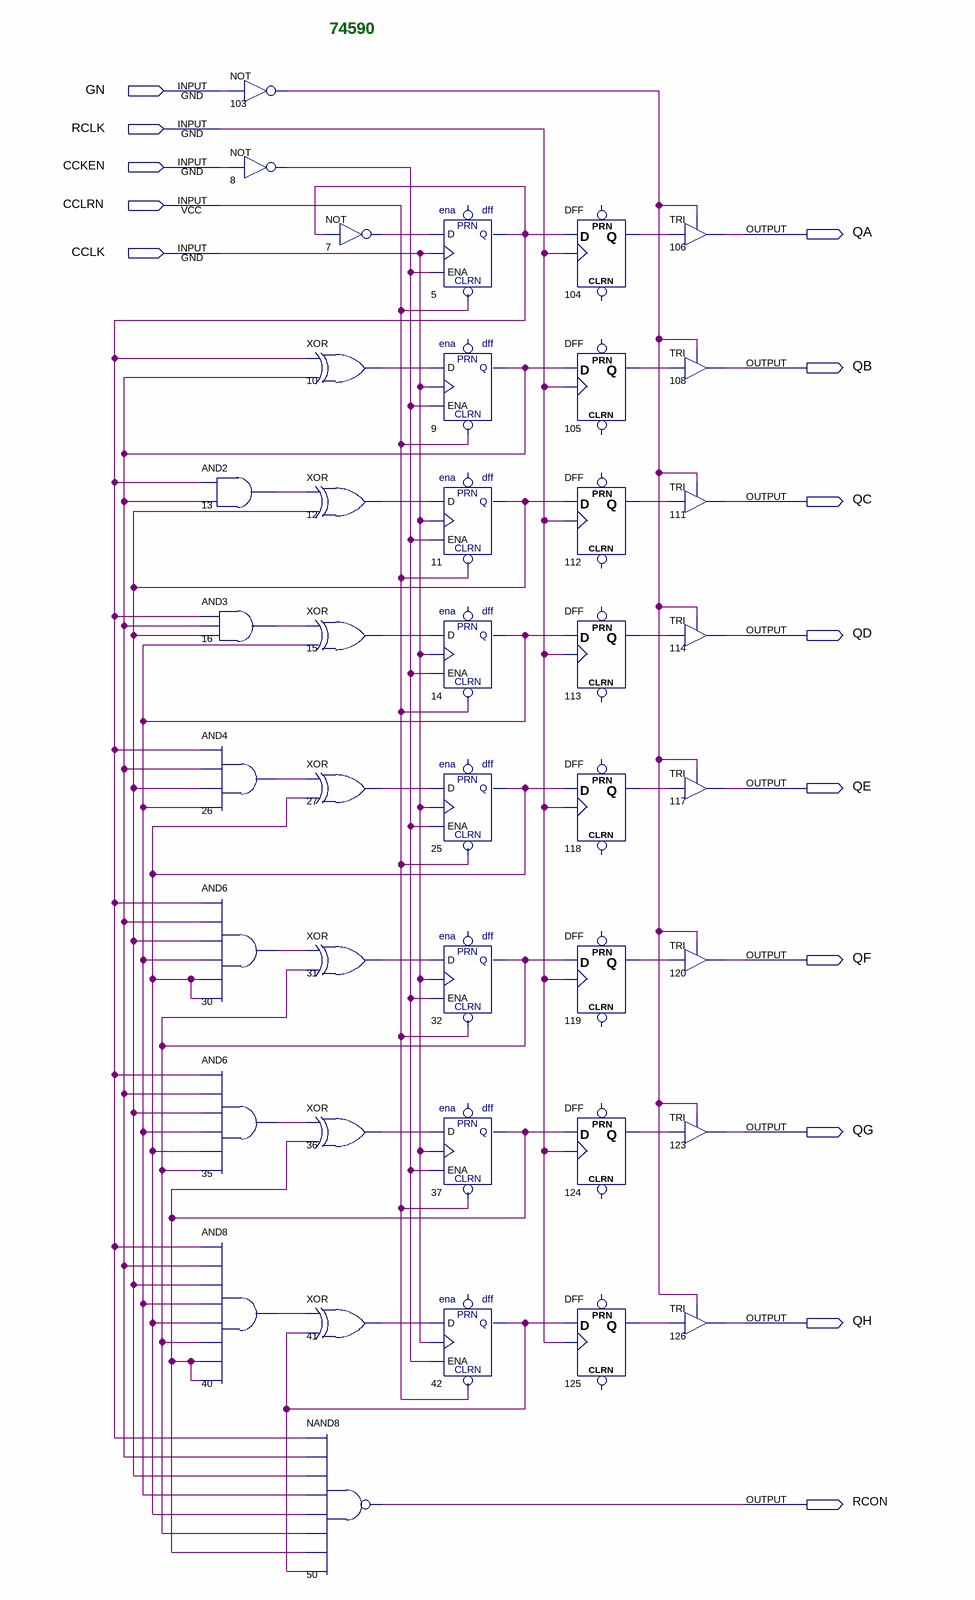
[diagram p0: schematic sheet]
// Quartus schematic 74590.bdf as structural Verilog: 41 symbols, 14 pins
module \74590  (
  input  GN,
  input  RCLK,
  input  CCKEN,
  input  CCLRN,
  input  CCLK,
  output QA,
  output QB,
  output QC,
  output QD,
  output QE,
  output QF,
  output QG,
  output QH,
  output RCON
);

  wire n5_q, n7_out, n8_out, n9_q, n10_out, n11_q, n12_out, n13_out, n14_q, n15_out, n16_out, n25_q, n26_out,
       n27_out, n30_out, n31_out, n32_q, n35_out, n36_out, n37_q, n40_out, n41_out, n42_q, n103_out, n104_q,
       n105_q, n112_q, n113_q, n118_q, n119_q, n124_q, n125_q;

  not u_103 (n103_out, GN);
  not u_8 (n8_out, CCKEN);
  and u_13 (n13_out, n5_q, n9_q);
  and u_16 (n16_out, n5_q, n9_q, n11_q);
  and u_26 (n26_out, n5_q, n9_q, n11_q, n14_q);
  and u_30 (n30_out, n5_q, n9_q, n11_q, n14_q, n25_q, n25_q);
  and u_35 (n35_out, n5_q, n9_q, n11_q, n14_q, n25_q, n32_q);
  and u_40 (n40_out, n5_q, n9_q, n11_q, n14_q, n25_q, n32_q, n37_q, n37_q);
  not u_7 (n7_out, n5_q);
  xor u_10 (n10_out, n5_q, n9_q);
  xor u_12 (n12_out, n13_out, n11_q);
  xor u_15 (n15_out, n16_out, n14_q);
  xor u_27 (n27_out, n26_out, n25_q);
  xor u_31 (n31_out, n30_out, n32_q);
  xor u_36 (n36_out, n35_out, n37_q);
  xor u_41 (n41_out, n40_out, n42_q);
  nand u_50 (RCON, n5_q, n9_q, n11_q, n14_q, n25_q, n32_q, n37_q, n42_q);
  enadff u_5 (.ENA(n8_out), .D(n7_out), .CLRN(CCLRN), .CLK(CCLK), .Q(n5_q));  // open: PRN
  enadff u_9 (.ENA(n8_out), .D(n10_out), .CLRN(CCLRN), .CLK(CCLK), .Q(n9_q));  // open: PRN
  enadff u_11 (.ENA(n8_out), .D(n12_out), .CLRN(CCLRN), .CLK(CCLK), .Q(n11_q));  // open: PRN
  enadff u_14 (.ENA(n8_out), .D(n15_out), .CLRN(CCLRN), .CLK(CCLK), .Q(n14_q));  // open: PRN
  enadff u_25 (.ENA(n8_out), .D(n27_out), .CLRN(CCLRN), .CLK(CCLK), .Q(n25_q));  // open: PRN
  enadff u_32 (.ENA(n8_out), .D(n31_out), .CLRN(CCLRN), .CLK(CCLK), .Q(n32_q));  // open: PRN
  enadff u_37 (.ENA(n8_out), .D(n36_out), .CLRN(CCLRN), .CLK(CCLK), .Q(n37_q));  // open: PRN
  enadff u_42 (.ENA(n8_out), .D(n41_out), .CLRN(CCLRN), .CLK(CCLK), .Q(n42_q));  // open: PRN
  DFF u_104 (.CLK(RCLK), .D(n5_q), .Q(n104_q));  // open: CLRN, PRN
  DFF u_105 (.CLK(RCLK), .D(n9_q), .Q(n105_q));  // open: CLRN, PRN
  DFF u_112 (.CLK(RCLK), .D(n11_q), .Q(n112_q));  // open: CLRN, PRN
  DFF u_113 (.CLK(RCLK), .D(n14_q), .Q(n113_q));  // open: CLRN, PRN
  DFF u_118 (.CLK(RCLK), .D(n25_q), .Q(n118_q));  // open: CLRN, PRN
  DFF u_119 (.CLK(RCLK), .D(n32_q), .Q(n119_q));  // open: CLRN, PRN
  DFF u_124 (.CLK(RCLK), .D(n37_q), .Q(n124_q));  // open: CLRN, PRN
  DFF u_125 (.CLK(RCLK), .D(n42_q), .Q(n125_q));  // open: CLRN, PRN
  TRI u_106 (.IN(n104_q), .OE(n103_out), .OUT(QA));
  TRI u_108 (.IN(n105_q), .OE(n103_out), .OUT(QB));
  TRI u_111 (.IN(n112_q), .OE(n103_out), .OUT(QC));
  TRI u_114 (.IN(n113_q), .OE(n103_out), .OUT(QD));
  TRI u_117 (.IN(n118_q), .OE(n103_out), .OUT(QE));
  TRI u_120 (.IN(n119_q), .OE(n103_out), .OUT(QF));
  TRI u_123 (.IN(n124_q), .OE(n103_out), .OUT(QG));
  TRI u_126 (.IN(n125_q), .OE(n103_out), .OUT(QH));

  // Notes on the sheet:
  //   74590
endmodule
